# Altium schematic sheet 14-RTL8367.schdoc
size A1
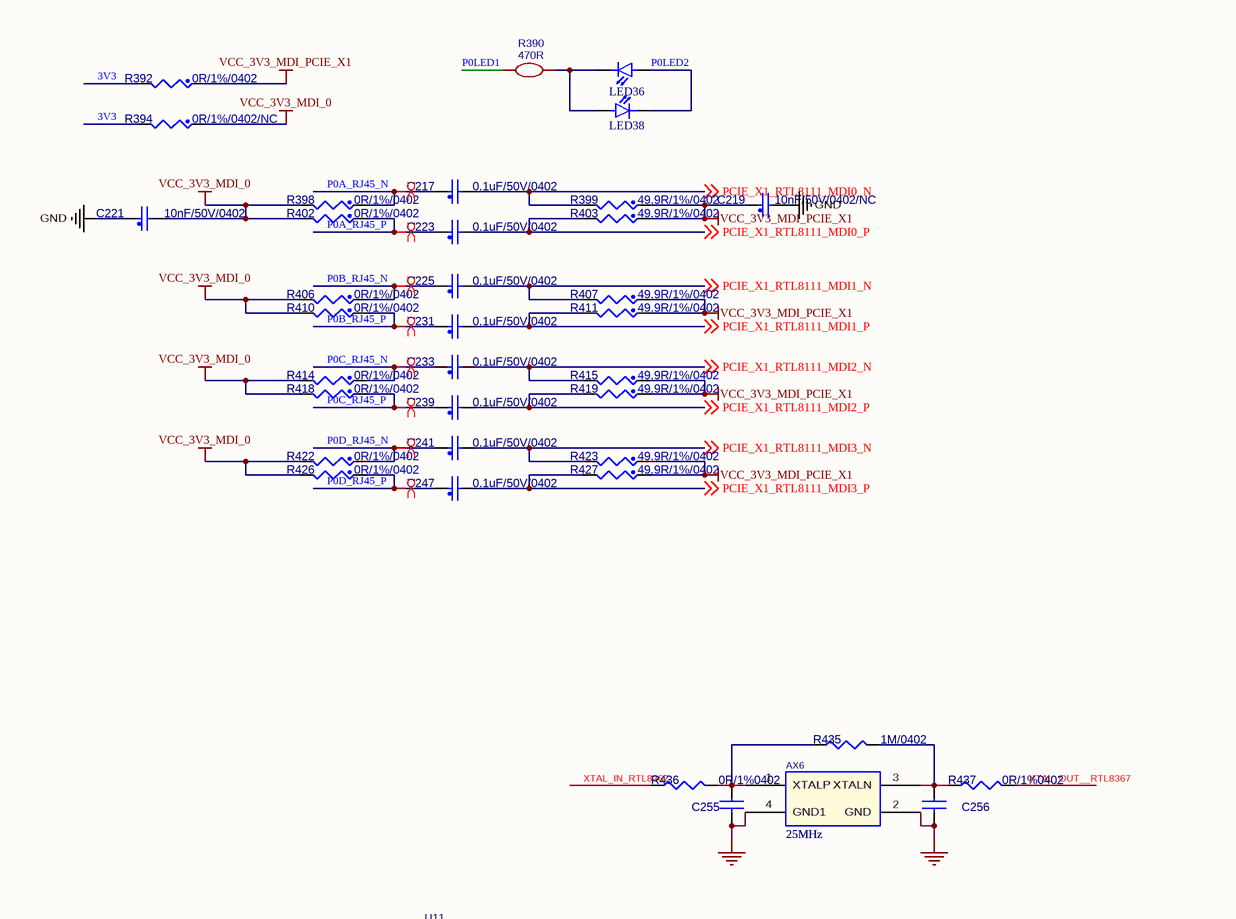
[diagram p0: 14-RTL8367.schdoc, top left]
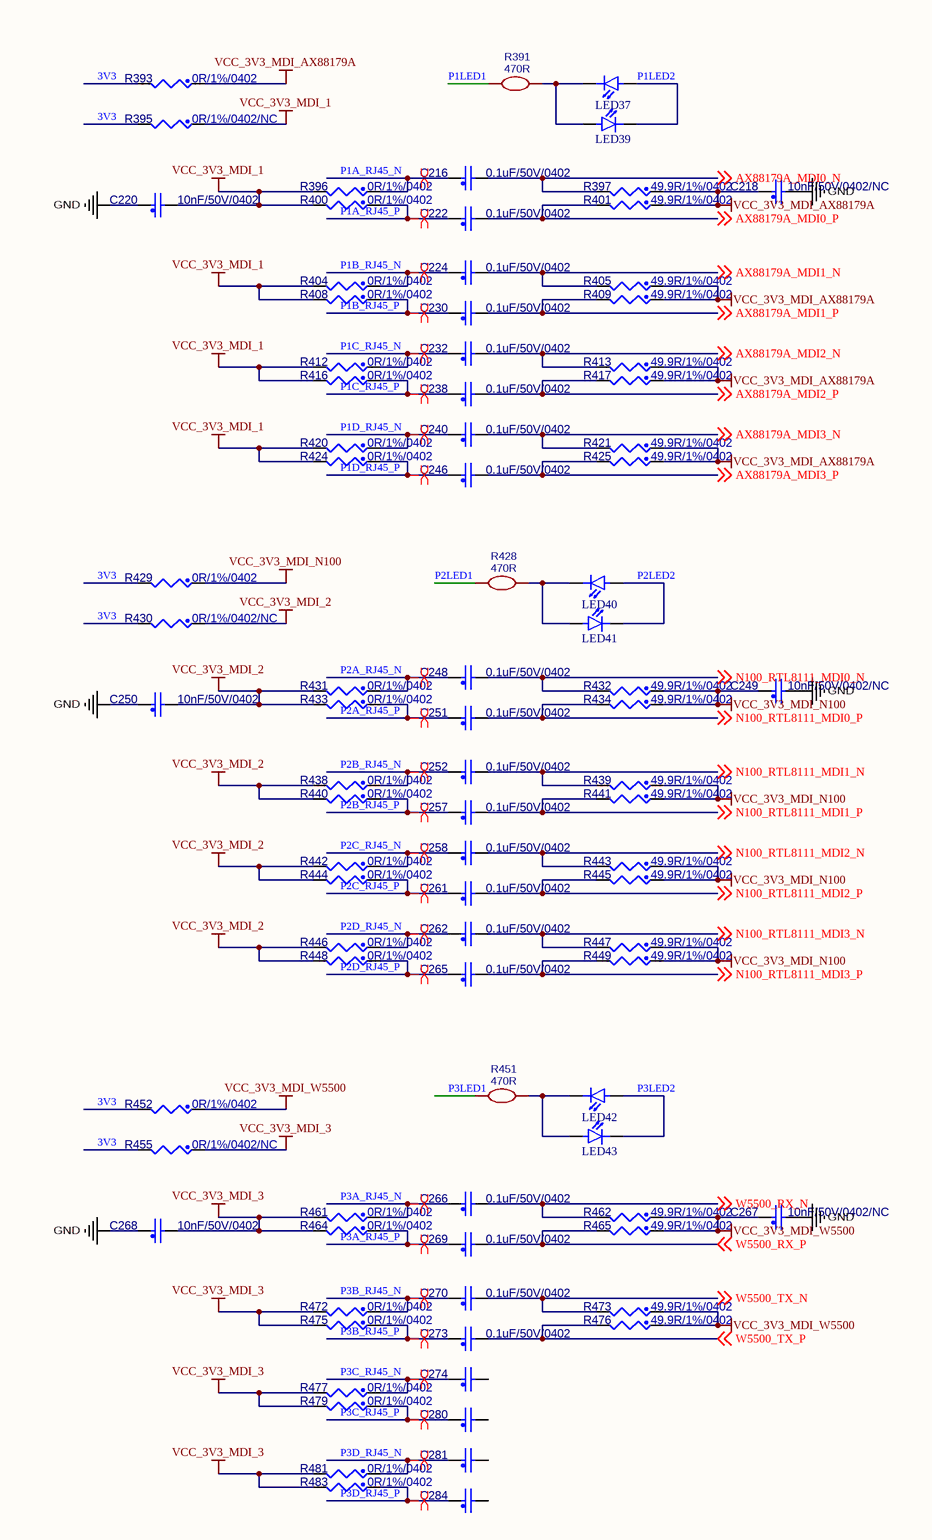
[diagram p1: 14-RTL8367.schdoc, top right]
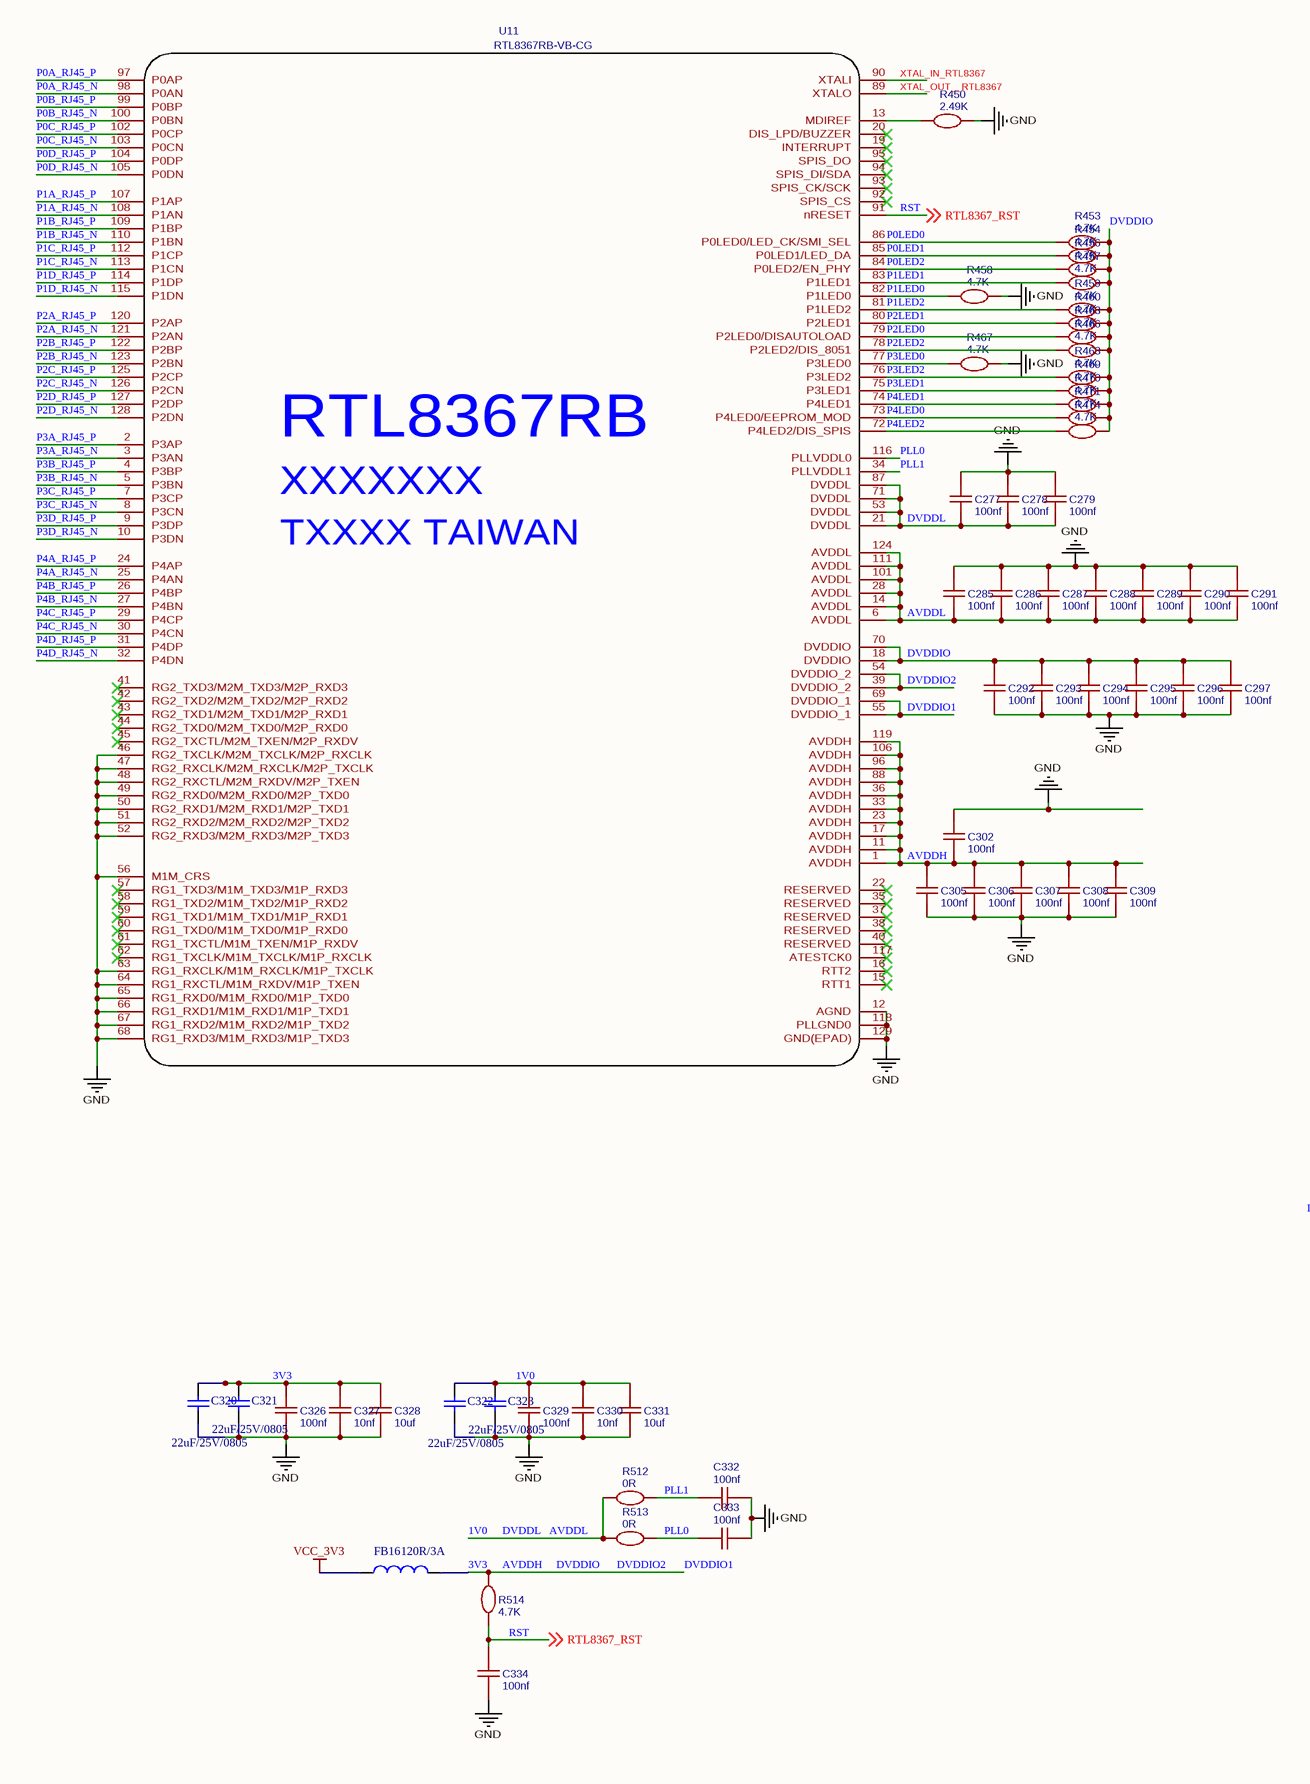
[diagram p2: 14-RTL8367.schdoc, bottom left]
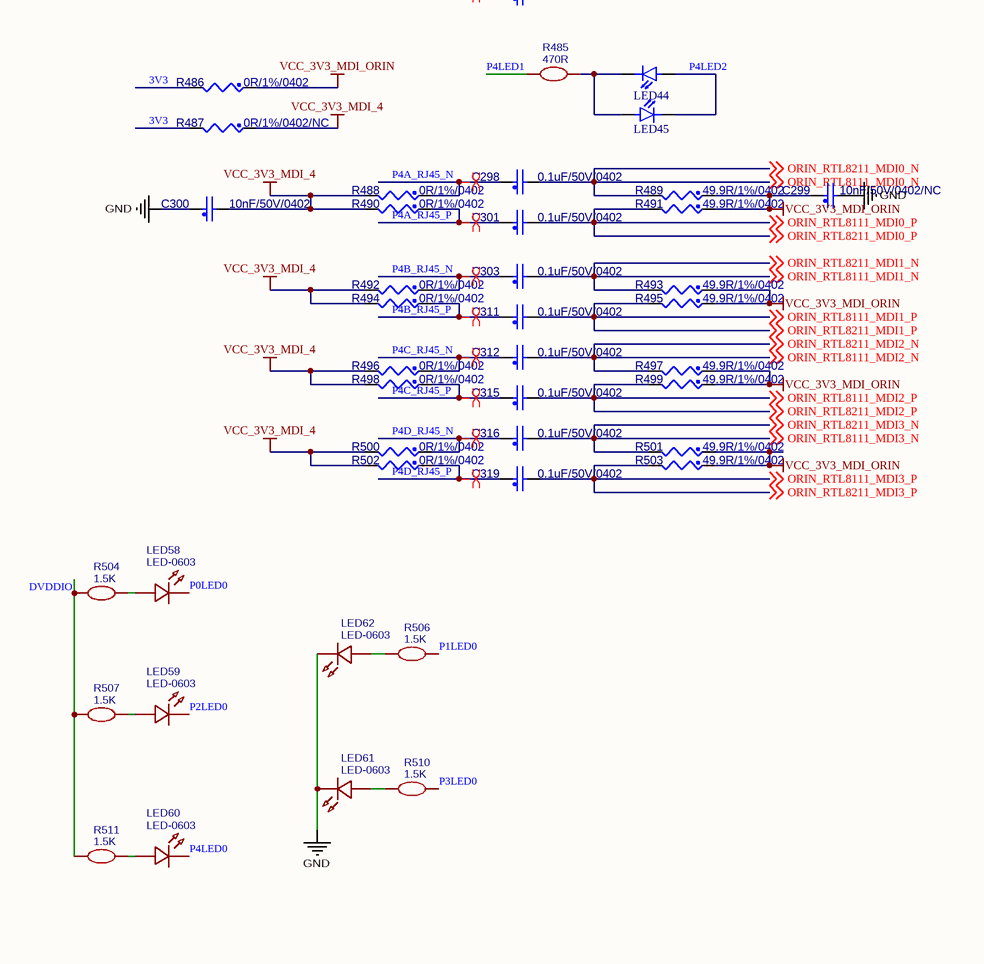
[diagram p3: 14-RTL8367.schdoc, bottom right]

## Parts
AX6  25MHz  [2016]
C216  value 0.1uF/50V/0402  [C0402]  (hidden comment: CAP_NP)
C217  value 0.1uF/50V/0402  [C0402]  (hidden comment: CAP_NP)
C218  value 10nF/50V/0402/NC  [C0402]  (hidden comment: CAP_NP)
C219  value 10nF/50V/0402/NC  [C0402]  (hidden comment: CAP_NP)
C220  value 10nF/50V/0402  [C0402]  (hidden comment: CAP_NP)
C221  value 10nF/50V/0402  [C0402]  (hidden comment: CAP_NP)
C222  value 0.1uF/50V/0402  [C0402]  (hidden comment: CAP_NP)
C223  value 0.1uF/50V/0402  [C0402]  (hidden comment: CAP_NP)
C224  value 0.1uF/50V/0402  [C0402]  (hidden comment: CAP_NP)
C225  value 0.1uF/50V/0402  [C0402]  (hidden comment: CAP_NP)
C230  value 0.1uF/50V/0402  [C0402]  (hidden comment: CAP_NP)
C231  value 0.1uF/50V/0402  [C0402]  (hidden comment: CAP_NP)
C232  value 0.1uF/50V/0402  [C0402]  (hidden comment: CAP_NP)
C233  value 0.1uF/50V/0402  [C0402]  (hidden comment: CAP_NP)
C238  value 0.1uF/50V/0402  [C0402]  (hidden comment: CAP_NP)
C239  value 0.1uF/50V/0402  [C0402]  (hidden comment: CAP_NP)
C240  value 0.1uF/50V/0402  [C0402]  (hidden comment: CAP_NP)
C241  value 0.1uF/50V/0402  [C0402]  (hidden comment: CAP_NP)
C246  value 0.1uF/50V/0402  [C0402]  (hidden comment: CAP_NP)
C247  value 0.1uF/50V/0402  [C0402]  (hidden comment: CAP_NP)
C248  value 0.1uF/50V/0402  [C0402]  (hidden comment: CAP_NP)
C249  value 10nF/50V/0402/NC  [C0402]  (hidden comment: CAP_NP)
C250  value 10nF/50V/0402  [C0402]  (hidden comment: CAP_NP)
C251  value 0.1uF/50V/0402  [C0402]  (hidden comment: CAP_NP)
C252  value 0.1uF/50V/0402  [C0402]  (hidden comment: CAP_NP)
C255  CAP NP_Dup3  [C0402]  (value not drawn)
C256  CAP NP_Dup3  [C0402]  (value not drawn)
C257  value 0.1uF/50V/0402  [C0402]  (hidden comment: CAP_NP)
C258  value 0.1uF/50V/0402  [C0402]  (hidden comment: CAP_NP)
C261  value 0.1uF/50V/0402  [C0402]  (hidden comment: CAP_NP)
C262  value 0.1uF/50V/0402  [C0402]  (hidden comment: CAP_NP)
C265  value 0.1uF/50V/0402  [C0402]  (hidden comment: CAP_NP)
C266  value 0.1uF/50V/0402  [C0402]  (hidden comment: CAP_NP)
C267  value 10nF/50V/0402/NC  [C0402]  (hidden comment: CAP_NP)
C268  value 10nF/50V/0402  [C0402]  (hidden comment: CAP_NP)
C269  value 0.1uF/50V/0402  [C0402]  (hidden comment: CAP_NP)
C270  value 0.1uF/50V/0402  [C0402]  (hidden comment: CAP_NP)
C273  value 0.1uF/50V/0402  [C0402]  (hidden comment: CAP_NP)
C274  CAP_NP  [C0402]  (value not drawn)
C277  100nf  [C0402]
C278  100nf  [C0402]
C279  100nf  [C0402]
C280  CAP_NP  [C0402]  (value not drawn)
C281  CAP_NP  [C0402]  (value not drawn)
C284  CAP_NP  [C0402]  (value not drawn)
C285  100nf  [C0402]
C286  100nf  [C0402]
C287  100nf  [C0402]
C288  100nf  [C0402]
C289  100nf  [C0402]
C290  100nf  [C0402]
C291  100nf  [C0402]
C292  100nf  [C0402]
C293  100nf  [C0402]
C294  100nf  [C0402]
C295  100nf  [C0402]
C296  100nf  [C0402]
C297  100nf  [C0402]
C298  value 0.1uF/50V/0402  [C0402]  (hidden comment: CAP_NP)
C299  value 10nF/50V/0402/NC  [C0402]  (hidden comment: CAP_NP)
C300  value 10nF/50V/0402  [C0402]  (hidden comment: CAP_NP)
C301  value 0.1uF/50V/0402  [C0402]  (hidden comment: CAP_NP)
C302  100nf  [C0402]
C303  value 0.1uF/50V/0402  [C0402]  (hidden comment: CAP_NP)
C305  100nf  [C0402]
C306  100nf  [C0402]
C307  100nf  [C0402]
C308  100nf  [C0402]
C309  100nf  [C0402]
C311  value 0.1uF/50V/0402  [C0402]  (hidden comment: CAP_NP)
C312  value 0.1uF/50V/0402  [C0402]  (hidden comment: CAP_NP)
C315  value 0.1uF/50V/0402  [C0402]  (hidden comment: CAP_NP)
C316  value 0.1uF/50V/0402  [C0402]  (hidden comment: CAP_NP)
C319  value 0.1uF/50V/0402  [C0402]  (hidden comment: CAP_NP)
C320  22uF/25V/0805  [C0805]
C321  22uF/25V/0805  [C0805]
C322  22uF/25V/0805  [C0805]
C323  22uF/25V/0805  [C0805]
C326  100nf  [C0402]
C327  10nf  [C0402]
C328  10uf  [C0805]
C329  100nf  [C0402]
C330  10nf  [C0402]
C331  10uf  [C0805]
C332  100nf  [C0402]
C333  100nf  [C0402]
C334  100nf  [C0402]
FB16  120R/3A  [L0603]
LED36  LED_GREEN  [LED0603]  (value not drawn)
LED37  LED_GREEN  [LED0603]  (value not drawn)
LED38  LED_GREEN  [LED0603]  (value not drawn)
LED39  LED_GREEN  [LED0603]  (value not drawn)
LED40  LED_GREEN  [LED0603]  (value not drawn)
LED41  LED_GREEN  [LED0603]  (value not drawn)
LED42  LED_GREEN  [LED0603]  (value not drawn)
LED43  LED_GREEN  [LED0603]  (value not drawn)
LED44  LED_GREEN  [LED0603]  (value not drawn)
LED45  LED_GREEN  [LED0603]  (value not drawn)
LED58  LED-0603  [LED0603]
LED59  LED-0603  [LED0603]
LED60  LED-0603  [LED0603]
LED61  LED-0603  [LED0603]
LED62  LED-0603  [LED0603]
R390  470R  [R0402]
R391  470R  [R0402]
R392  value 0R/1%/0402  [R0402]  (hidden comment: RES_Dup2)
R393  value 0R/1%/0402  [R0402]  (hidden comment: RES_Dup2)
R394  value 0R/1%/0402/NC  [R0402]  (hidden comment: RES_Dup2)
R395  value 0R/1%/0402/NC  [R0402]  (hidden comment: RES_Dup2)
R396  value 0R/1%/0402  [R0402]  (hidden comment: RES_Dup2)
R397  value 49.9R/1%/0402  [R0402]  (hidden comment: RES_Dup2)
R398  value 0R/1%/0402  [R0402]  (hidden comment: RES_Dup2)
R399  value 49.9R/1%/0402  [R0402]  (hidden comment: RES_Dup2)
R400  value 0R/1%/0402  [R0402]  (hidden comment: RES_Dup2)
R401  value 49.9R/1%/0402  [R0402]  (hidden comment: RES_Dup2)
R402  value 0R/1%/0402  [R0402]  (hidden comment: RES_Dup2)
R403  value 49.9R/1%/0402  [R0402]  (hidden comment: RES_Dup2)
R404  value 0R/1%/0402  [R0402]  (hidden comment: RES_Dup2)
R405  value 49.9R/1%/0402  [R0402]  (hidden comment: RES_Dup2)
R406  value 0R/1%/0402  [R0402]  (hidden comment: RES_Dup2)
R407  value 49.9R/1%/0402  [R0402]  (hidden comment: RES_Dup2)
R408  value 0R/1%/0402  [R0402]  (hidden comment: RES_Dup2)
R409  value 49.9R/1%/0402  [R0402]  (hidden comment: RES_Dup2)
R410  value 0R/1%/0402  [R0402]  (hidden comment: RES_Dup2)
R411  value 49.9R/1%/0402  [R0402]  (hidden comment: RES_Dup2)
R412  value 0R/1%/0402  [R0402]  (hidden comment: RES_Dup2)
R413  value 49.9R/1%/0402  [R0402]  (hidden comment: RES_Dup2)
R414  value 0R/1%/0402  [R0402]  (hidden comment: RES_Dup2)
R415  value 49.9R/1%/0402  [R0402]  (hidden comment: RES_Dup2)
R416  value 0R/1%/0402  [R0402]  (hidden comment: RES_Dup2)
R417  value 49.9R/1%/0402  [R0402]  (hidden comment: RES_Dup2)
R418  value 0R/1%/0402  [R0402]  (hidden comment: RES_Dup2)
R419  value 49.9R/1%/0402  [R0402]  (hidden comment: RES_Dup2)
R420  value 0R/1%/0402  [R0402]  (hidden comment: RES_Dup2)
R421  value 49.9R/1%/0402  [R0402]  (hidden comment: RES_Dup2)
R422  value 0R/1%/0402  [R0402]  (hidden comment: RES_Dup2)
R423  value 49.9R/1%/0402  [R0402]  (hidden comment: RES_Dup2)
R424  value 0R/1%/0402  [R0402]  (hidden comment: RES_Dup2)
R425  value 49.9R/1%/0402  [R0402]  (hidden comment: RES_Dup2)
R426  value 0R/1%/0402  [R0402]  (hidden comment: RES_Dup2)
R427  value 49.9R/1%/0402  [R0402]  (hidden comment: RES_Dup2)
R428  470R  [R0402]
R429  value 0R/1%/0402  [R0402]  (hidden comment: RES_Dup2)
R430  value 0R/1%/0402/NC  [R0402]  (hidden comment: RES_Dup2)
R431  value 0R/1%/0402  [R0402]  (hidden comment: RES_Dup2)
R432  value 49.9R/1%/0402  [R0402]  (hidden comment: RES_Dup2)
R433  value 0R/1%/0402  [R0402]  (hidden comment: RES_Dup2)
R434  value 49.9R/1%/0402  [R0402]  (hidden comment: RES_Dup2)
R435  value 1M/0402  [R0402]  (hidden comment: R_Dup3)
R436  value 0R/1%0402  [R0402]  (hidden comment: R_Dup3)
R437  value 0R/1%0402  [R0402]  (hidden comment: R_Dup3)
R438  value 0R/1%/0402  [R0402]  (hidden comment: RES_Dup2)
R439  value 49.9R/1%/0402  [R0402]  (hidden comment: RES_Dup2)
R440  value 0R/1%/0402  [R0402]  (hidden comment: RES_Dup2)
R441  value 49.9R/1%/0402  [R0402]  (hidden comment: RES_Dup2)
R442  value 0R/1%/0402  [R0402]  (hidden comment: RES_Dup2)
R443  value 49.9R/1%/0402  [R0402]  (hidden comment: RES_Dup2)
R444  value 0R/1%/0402  [R0402]  (hidden comment: RES_Dup2)
R445  value 49.9R/1%/0402  [R0402]  (hidden comment: RES_Dup2)
R446  value 0R/1%/0402  [R0402]  (hidden comment: RES_Dup2)
R447  value 49.9R/1%/0402  [R0402]  (hidden comment: RES_Dup2)
R448  value 0R/1%/0402  [R0402]  (hidden comment: RES_Dup2)
R449  value 49.9R/1%/0402  [R0402]  (hidden comment: RES_Dup2)
R450  2.49K  [R0402]
R451  470R  [R0402]
R452  value 0R/1%/0402  [R0402]  (hidden comment: RES_Dup2)
R453  4.7K  [R0402]
R454  4.7K  [R0402]
R455  value 0R/1%/0402/NC  [R0402]  (hidden comment: RES_Dup2)
R456  4.7K  [R0402]
R457  4.7K  [R0402]
R458  4.7K  [R0402]
R459  4.7K  [R0402]
R460  4.7K  [R0402]
R461  value 0R/1%/0402  [R0402]  (hidden comment: RES_Dup2)
R462  value 49.9R/1%/0402  [R0402]  (hidden comment: RES_Dup2)
R463  4.7K  [R0402]
R464  value 0R/1%/0402  [R0402]  (hidden comment: RES_Dup2)
R465  value 49.9R/1%/0402  [R0402]  (hidden comment: RES_Dup2)
R466  4.7K  [R0402]
R467  4.7K  [R0402]
R468  4.7K  [R0402]
R469  4.7K  [R0402]
R470  4.7K  [R0402]
R471  4.7K  [R0402]
R472  value 0R/1%/0402  [R0402]  (hidden comment: RES_Dup2)
R473  value 49.9R/1%/0402  [R0402]  (hidden comment: RES_Dup2)
R474  4.7K  [R0402]
R475  value 0R/1%/0402  [R0402]  (hidden comment: RES_Dup2)
R476  value 49.9R/1%/0402  [R0402]  (hidden comment: RES_Dup2)
R477  value 0R/1%/0402  [R0402]  (hidden comment: RES_Dup2)
R479  value 0R/1%/0402  [R0402]  (hidden comment: RES_Dup2)
R481  value 0R/1%/0402  [R0402]  (hidden comment: RES_Dup2)
R483  value 0R/1%/0402  [R0402]  (hidden comment: RES_Dup2)
R485  470R  [R0402]
R486  value 0R/1%/0402  [R0402]  (hidden comment: RES_Dup2)
R487  value 0R/1%/0402/NC  [R0402]  (hidden comment: RES_Dup2)
R488  value 0R/1%/0402  [R0402]  (hidden comment: RES_Dup2)
R489  value 49.9R/1%/0402  [R0402]  (hidden comment: RES_Dup2)
R490  value 0R/1%/0402  [R0402]  (hidden comment: RES_Dup2)
R491  value 49.9R/1%/0402  [R0402]  (hidden comment: RES_Dup2)
R492  value 0R/1%/0402  [R0402]  (hidden comment: RES_Dup2)
R493  value 49.9R/1%/0402  [R0402]  (hidden comment: RES_Dup2)
R494  value 0R/1%/0402  [R0402]  (hidden comment: RES_Dup2)
R495  value 49.9R/1%/0402  [R0402]  (hidden comment: RES_Dup2)
R496  value 0R/1%/0402  [R0402]  (hidden comment: RES_Dup2)
R497  value 49.9R/1%/0402  [R0402]  (hidden comment: RES_Dup2)
R498  value 0R/1%/0402  [R0402]  (hidden comment: RES_Dup2)
R499  value 49.9R/1%/0402  [R0402]  (hidden comment: RES_Dup2)
R500  value 0R/1%/0402  [R0402]  (hidden comment: RES_Dup2)
R501  value 49.9R/1%/0402  [R0402]  (hidden comment: RES_Dup2)
R502  value 0R/1%/0402  [R0402]  (hidden comment: RES_Dup2)
R503  value 49.9R/1%/0402  [R0402]  (hidden comment: RES_Dup2)
R504  1.5K  [R0402]
R506  1.5K  [R0402]
R507  1.5K  [R0402]
R510  1.5K  [R0402]
R511  1.5K  [R0402]
R512  0R  [R0402]
R513  0R  [R0402]
R514  4.7K  [R0402]
U11  RTL8367RB-VB-CG  [RTL8367RB_LQFP128]

## Nets
GND: AX6.2(GND) AX6.4(GND1) C218.2 C219.2 C220.1 C221.1 C249.2 C250.1 C255.2 C256.2 C267.2 C268.1 C277.1 C278.1 C279.1 C285.1 C286.1 C287.1 C288.1 C289.1 C290.1 C291.1 C292.2 C293.2 C294.2 C295.2 C296.2 C297.2 C299.2 C300.1 C302.1 C305.2 C306.2 C307.2 C308.2 C309.2 C320.1 C321.1 C322.1 C323.1 C326.2 C327.2 C328.2 C329.2 C330.2 C331.2 C332.2 C333.2 C334.2 LED61.2 LED62.2 R450.2 R458.2 R467.2 U11.12(AGND) U11.46(RG2_TXCLK/M2M_TXCLK/M2P_RXCLK) U11.47(RG2_RXCLK/M2M_RXCLK/M2P_TXCLK) U11.48(RG2_RXCTL/M2M_RXDV/M2P_TXEN) U11.49(RG2_RXD0/M2M_RXD0/M2P_TXD0) U11.50(RG2_RXD1/M2M_RXD1/M2P_TXD1) U11.51(RG2_RXD2/M2M_RXD2/M2P_TXD2) U11.52(RG2_RXD3/M2M_RXD3/M2P_TXD3) U11.56(M1M_CRS) U11.63(RG1_RXCLK/M1M_RXCLK/M1P_TXCLK) U11.64(RG1_RXCTL/M1M_RXDV/M1P_TXEN) U11.65(RG1_RXD0/M1M_RXD0/M1P_TXD0) U11.66(RG1_RXD1/M1M_RXD1/M1P_TXD1) U11.67(RG1_RXD2/M1M_RXD2/M1P_TXD2) U11.68(RG1_RXD3/M1M_RXD3/M1P_TXD3) U11.118(PLLGND0) U11.129(GND(EPAD))
VCC_3V3: FB16.1
VCC_3V3_MDI_0: C221.2 R394.1 R398.2 R402.2 R406.2 R410.2 R414.2 R418.2 R422.2 R426.2
VCC_3V3_MDI_1: C220.2 R395.1 R396.2 R400.2 R404.2 R408.2 R412.2 R416.2 R420.2 R424.2
VCC_3V3_MDI_2: C250.2 R430.1 R431.2 R433.2 R438.2 R440.2 R442.2 R444.2 R446.2 R448.2
VCC_3V3_MDI_3: C268.2 R455.1 R461.2 R464.2 R472.2 R475.2 R477.2 R479.2 R481.2 R483.2
VCC_3V3_MDI_4: C300.2 R487.1 R488.2 R490.2 R492.2 R494.2 R496.2 R498.2 R500.2 R502.2
VCC_3V3_MDI_AX88179A: C218.1 R393.1 R397.1 R401.1 R405.1 R409.1 R413.1 R417.1 R421.1 R425.1
VCC_3V3_MDI_N100: C249.1 R429.1 R432.1 R434.1 R439.1 R441.1 R443.1 R445.1 R447.1 R449.1
VCC_3V3_MDI_ORIN: C299.1 R486.1 R489.1 R491.1 R493.1 R495.1 R497.1 R499.1 R501.1 R503.1
VCC_3V3_MDI_PCIE_X1: C219.1 R392.1 R399.1 R403.1 R407.1 R411.1 R415.1 R419.1 R423.1 R427.1
VCC_3V3_MDI_W5500: C267.1 R452.1 R462.1 R465.1 R473.1 R476.1
1V0: C277.2 C278.2 C279.2 C285.2 C286.2 C287.2 C288.2 C289.2 C290.2 C291.2 C322.2 C323.2 C329.1 C330.1 C331.1 R512.1 R513.1 U11.6(AVDDL) U11.14(AVDDL) U11.21(DVDDL) U11.28(AVDDL) U11.53(DVDDL) U11.71(DVDDL) U11.87(DVDDL) U11.101(AVDDL) U11.111(AVDDL) U11.124(AVDDL)  [also labelled AVDDL, DVDDL]
3V3: C292.1 C293.1 C294.1 C295.1 C296.1 C297.1 C302.2 C305.1 C306.1 C307.1 C308.1 C309.1 C320.2 C321.2 C326.1 C327.1 C328.1 FB16.2 R392.2 R393.2 R394.2 R395.2 R429.2 R430.2 R452.2 R453.2 R454.2 R455.2 R456.2 R457.2 R459.2 R460.2 R463.2 R466.2 R468.2 R469.2 R470.2 R471.2 R474.2 R486.2 R487.2 R504.1 R507.1 R511.1 R514.2 U11.1(AVDDH) U11.11(AVDDH) U11.17(AVDDH) U11.18(DVDDIO) U11.23(AVDDH) U11.33(AVDDH) U11.36(AVDDH) U11.39(DVDDIO_2) U11.54(DVDDIO_2) U11.55(DVDDIO_1) U11.69(DVDDIO_1) U11.70(DVDDIO) U11.88(AVDDH) U11.96(AVDDH) U11.106(AVDDH) U11.119(AVDDH)  [also labelled AVDDH, DVDDIO, DVDDIO1, DVDDIO2]
AX88179A_MDI0_N: C216.2 R397.2 ; off-sheet AX88179A_MDI0_N
AX88179A_MDI0_P: C222.2 R401.2 ; off-sheet AX88179A_MDI0_P
AX88179A_MDI1_N: C224.2 R405.2 ; off-sheet AX88179A_MDI1_N
AX88179A_MDI1_P: C230.2 R409.2 ; off-sheet AX88179A_MDI1_P
AX88179A_MDI2_N: C232.2 R413.2 ; off-sheet AX88179A_MDI2_N
AX88179A_MDI2_P: C238.2 R417.2 ; off-sheet AX88179A_MDI2_P
AX88179A_MDI3_N: C240.2 R421.2 ; off-sheet AX88179A_MDI3_N
AX88179A_MDI3_P: C246.2 R425.2 ; off-sheet AX88179A_MDI3_P
N100_RTL8111_MDI0_N: C248.2 R432.2 ; off-sheet N100_RTL8111_MDI0_N
N100_RTL8111_MDI0_P: C251.2 R434.2 ; off-sheet N100_RTL8111_MDI0_P
N100_RTL8111_MDI1_N: C252.2 R439.2 ; off-sheet N100_RTL8111_MDI1_N
N100_RTL8111_MDI1_P: C257.2 R441.2 ; off-sheet N100_RTL8111_MDI1_P
N100_RTL8111_MDI2_N: C258.2 R443.2 ; off-sheet N100_RTL8111_MDI2_N
N100_RTL8111_MDI2_P: C261.2 R445.2 ; off-sheet N100_RTL8111_MDI2_P
N100_RTL8111_MDI3_N: C262.2 R447.2 ; off-sheet N100_RTL8111_MDI3_N
N100_RTL8111_MDI3_P: C265.2 R449.2 ; off-sheet N100_RTL8111_MDI3_P
ORIN_RTL8111_MDI0_N: C298.2 R489.2 ; off-sheet ORIN_RTL8211_MDI0_N, off-sheet ORIN_RTL8111_MDI0_N  [also labelled ORIN_RTL8211_MDI0_N]
ORIN_RTL8111_MDI0_P: C301.2 R491.2 ; off-sheet ORIN_RTL8211_MDI0_P, off-sheet ORIN_RTL8111_MDI0_P  [also labelled ORIN_RTL8211_MDI0_P]
ORIN_RTL8111_MDI1_N: C303.2 R493.2 ; off-sheet ORIN_RTL8211_MDI1_N, off-sheet ORIN_RTL8111_MDI1_N  [also labelled ORIN_RTL8211_MDI1_N]
ORIN_RTL8111_MDI1_P: C311.2 R495.2 ; off-sheet ORIN_RTL8211_MDI1_P, off-sheet ORIN_RTL8111_MDI1_P  [also labelled ORIN_RTL8211_MDI1_P]
ORIN_RTL8111_MDI2_N: C312.2 R497.2 ; off-sheet ORIN_RTL8211_MDI2_N, off-sheet ORIN_RTL8111_MDI2_N  [also labelled ORIN_RTL8211_MDI2_N]
ORIN_RTL8111_MDI2_P: C315.2 R499.2 ; off-sheet ORIN_RTL8211_MDI2_P, off-sheet ORIN_RTL8111_MDI2_P  [also labelled ORIN_RTL8211_MDI2_P]
ORIN_RTL8111_MDI3_N: C316.2 R501.2 ; off-sheet ORIN_RTL8211_MDI3_N, off-sheet ORIN_RTL8111_MDI3_N  [also labelled ORIN_RTL8211_MDI3_N]
ORIN_RTL8111_MDI3_P: C319.2 R503.2 ; off-sheet ORIN_RTL8211_MDI3_P, off-sheet ORIN_RTL8111_MDI3_P  [also labelled ORIN_RTL8211_MDI3_P]
P0A_RJ45_N: C217.1 R398.1 U11.98(P0AN)
P0A_RJ45_P: C223.1 R402.1 U11.97(P0AP)
P0B_RJ45_N: C225.1 R406.1 U11.100(P0BN)
P0B_RJ45_P: C231.1 R410.1 U11.99(P0BP)
P0C_RJ45_N: C233.1 R414.1 U11.103(P0CN)
P0C_RJ45_P: C239.1 R418.1 U11.102(P0CP)
P0D_RJ45_N: C241.1 R422.1 U11.105(P0DN)
P0D_RJ45_P: C247.1 R426.1 U11.104(P0DP)
P0LED0: LED58.2 R453.1 U11.86(P0LED0/LED_CK/SMI_SEL)
P0LED1: R390.1 R454.1 U11.85(P0LED1/LED_DA)
P0LED2: LED36.1 LED38.2 R456.1 U11.84(P0LED2/EN_PHY)
P1A_RJ45_N: C216.1 R396.1 U11.108(P1AN)
P1A_RJ45_P: C222.1 R400.1 U11.107(P1AP)
P1B_RJ45_N: C224.1 R404.1 U11.110(P1BN)
P1B_RJ45_P: C230.1 R408.1 U11.109(P1BP)
P1C_RJ45_N: C232.1 R412.1 U11.113(P1CN)
P1C_RJ45_P: C238.1 R416.1 U11.112(P1CP)
P1D_RJ45_N: C240.1 R420.1 U11.115(P1DN)
P1D_RJ45_P: C246.1 R424.1 U11.114(P1DP)
P1LED0: R458.1 R506.2 U11.82(P1LED0)
P1LED1: R391.1 R457.1 U11.83(P1LED1)
P1LED2: LED37.1 LED39.2 R459.1 U11.81(P1LED2)
P2A_RJ45_N: C248.1 R431.1 U11.121(P2AN)
P2A_RJ45_P: C251.1 R433.1 U11.120(P2AP)
P2B_RJ45_N: C252.1 R438.1 U11.123(P2BN)
P2B_RJ45_P: C257.1 R440.1 U11.122(P2BP)
P2C_RJ45_N: C258.1 R442.1 U11.126(P2CN)
P2C_RJ45_P: C261.1 R444.1 U11.125(P2CP)
P2D_RJ45_N: C262.1 R446.1 U11.128(P2DN)
P2D_RJ45_P: C265.1 R448.1 U11.127(P2DP)
P2LED0: LED59.2 R463.1 U11.79(P2LED0/DISAUTOLOAD)
P2LED1: R428.1 R460.1 U11.80(P2LED1)
P2LED2: LED40.1 LED41.2 R466.1 U11.78(P2LED2/DIS_8051)
P3A_RJ45_N: C266.1 R461.1 U11.3(P3AN)
P3A_RJ45_P: C269.1 R464.1 U11.2(P3AP)
P3B_RJ45_N: C270.1 R472.1 U11.5(P3BN)
P3B_RJ45_P: C273.1 R475.1 U11.4(P3BP)
P3C_RJ45_N: C274.1 R477.1 U11.8(P3CN)
P3C_RJ45_P: C280.1 R479.1 U11.7(P3CP)
P3D_RJ45_N: C281.1 R481.1 U11.10(P3DN)
P3D_RJ45_P: C284.1 R483.1 U11.9(P3DP)
P3LED0: R467.1 R510.2 U11.77(P3LED0)
P3LED1: R451.1 R469.1 U11.75(P3LED1)
P3LED2: LED42.1 LED43.2 R468.1 U11.76(P3LED2)
P4A_RJ45_N: C298.1 R488.1 U11.25(P4AN)
P4A_RJ45_P: C301.1 R490.1 U11.24(P4AP)
P4B_RJ45_N: C303.1 R492.1 U11.27(P4BN)
P4B_RJ45_P: C311.1 R494.1 U11.26(P4BP)
P4C_RJ45_N: C312.1 R496.1 U11.30(P4CN)
P4C_RJ45_P: C315.1 R498.1 U11.29(P4CP)
P4D_RJ45_N: C316.1 R500.1 U11.32(P4DN)
P4D_RJ45_P: C319.1 R502.1 U11.31(P4DP)
P4LED0: LED60.2 R471.1 U11.73(P4LED0/EEPROM_MOD)
P4LED1: R470.1 R485.1 U11.74(P4LED1)
P4LED2: LED44.1 LED45.2 R474.1 U11.72(P4LED2/DIS_SPIS)
PCIE_X1_RTL8111_MDI0_N: C217.2 R399.2 ; off-sheet PCIE_X1_RTL8111_MDI0_N
PCIE_X1_RTL8111_MDI0_P: C223.2 R403.2 ; off-sheet PCIE_X1_RTL8111_MDI0_P
PCIE_X1_RTL8111_MDI1_N: C225.2 R407.2 ; off-sheet PCIE_X1_RTL8111_MDI1_N
PCIE_X1_RTL8111_MDI1_P: C231.2 R411.2 ; off-sheet PCIE_X1_RTL8111_MDI1_P
PCIE_X1_RTL8111_MDI2_N: C233.2 R415.2 ; off-sheet PCIE_X1_RTL8111_MDI2_N
PCIE_X1_RTL8111_MDI2_P: C239.2 R419.2 ; off-sheet PCIE_X1_RTL8111_MDI2_P
PCIE_X1_RTL8111_MDI3_N: C241.2 R423.2 ; off-sheet PCIE_X1_RTL8111_MDI3_N
PCIE_X1_RTL8111_MDI3_P: C247.2 R427.2 ; off-sheet PCIE_X1_RTL8111_MDI3_P
PLL0: C333.1 R513.2 U11.116(PLLVDDL0)
PLL1: C332.1 R512.2 U11.34(PLLVDDL1)
RST: C334.1 R514.1 U11.91(nRESET) ; off-sheet RTL8367_RST  [also labelled RTL8367_RST]
W5500_RX_N: C266.2 R462.2 ; off-sheet W5500_RX_N
W5500_RX_P: C269.2 R465.2 ; off-sheet W5500_RX_P
W5500_TX_N: C270.2 R473.2 ; off-sheet W5500_TX_N
W5500_TX_P: C273.2 R476.2 ; off-sheet W5500_TX_P
XTAL_IN_RTL8367: R436.1 U11.90(XTALI)
XTAL_OUT__RTL8367: R437.2 U11.89(XTALO)
NetAX6_1: AX6.1(XTALP) C255.1 R435.1 R436.2
NetAX6_3: AX6.3(XTALN) C256.1 R435.2 R437.1
NetLED36_2: LED36.2 LED38.1 R390.2
NetLED37_2: LED37.2 LED39.1 R391.2
NetLED40_2: LED40.2 LED41.1 R428.2
NetLED42_2: LED42.2 LED43.1 R451.2
NetLED44_2: LED44.2 LED45.1 R485.2
NetLED58_1: LED58.1 R504.2
NetLED59_1: LED59.1 R507.2
NetLED60_1: LED60.1 R511.2
NetLED61_1: LED61.1 R510.1
NetLED62_1: LED62.1 R506.1
NetR450_1: R450.1 U11.13(MDIREF)

Not connected (* = marked no-connect by the designer): C274 2; C280 2; C281 2; C284 2; U11 15(RTT1)* 16(RTT2)* 19(INTERRUPT)* 20(DIS_LPD/BUZZER)* 22(RESERVED)* 35(RESERVED)* 37(RESERVED)* 38(RESERVED)* 40(RESERVED)* 41(RG2_TXD3/M2M_TXD3/M2P_RXD3)* 42(RG2_TXD2/M2M_TXD2/M2P_RXD2)* 43(RG2_TXD1/M2M_TXD1/M2P_RXD1)* 44(RG2_TXD0/M2M_TXD0/M2P_RXD0)* 45(RG2_TXCTL/M2M_TXEN/M2P_RXDV)* 57(RG1_TXD3/M1M_TXD3/M1P_RXD3)* 58(RG1_TXD2/M1M_TXD2/M1P_RXD2)* 59(RG1_TXD1/M1M_TXD1/M1P_RXD1)* 60(RG1_TXD0/M1M_TXD0/M1P_RXD0)* 61(RG1_TXCTL/M1M_TXEN/M1P_RXDV)* 62(RG1_TXCLK/M1M_TXCLK/M1P_RXCLK)* 92(SPIS_CS)* 93(SPIS_CK/SCK)* 94(SPIS_DI/SDA)* 95(SPIS_DO)* 117(ATESTCK0)*

## Layout directives
differential pair: P0A_RJ45_N, P0A_RJ45_P, P0B_RJ45_N, P0B_RJ45_P, P0C_RJ45_N, P0C_RJ45_P, P0D_RJ45_N, P0D_RJ45_P, P1A_RJ45_N, P1A_RJ45_P, P1B_RJ45_N, P1B_RJ45_P, P1C_RJ45_N, P1C_RJ45_P, P1D_RJ45_N, P1D_RJ45_P, P2A_RJ45_N, P2A_RJ45_P, P2B_RJ45_N, P2B_RJ45_P, P2C_RJ45_N, P2C_RJ45_P, P2D_RJ45_N, P2D_RJ45_P, P3A_RJ45_N, P3A_RJ45_P, P3B_RJ45_N, P3B_RJ45_P, P3C_RJ45_N, P3C_RJ45_P, P3D_RJ45_N, P3D_RJ45_P, P4A_RJ45_N, P4A_RJ45_P, P4B_RJ45_N, P4B_RJ45_P, P4C_RJ45_N, P4C_RJ45_P, P4D_RJ45_N, P4D_RJ45_P

## Notes on the sheet
- (in symbol RTL8367RB-VB-CG) RTL8367RB; XXXXXXX; TXXXX TAIWAN

## Library data of the parts
AX6 = XTAL_0: Part Reference: AX3; PCB Footprint: CRY5032; Value: 25MHz
C216-C225 C230-C233 C238-C241 C246-C252 C257 C258 C261 C262 C265-C270 C273 C274 C280 C281 C284 C298-C301 C303 C311 C312 C315 C316 C319 = CAP_NP: GCM155R71H104KE02/MURATA; Part Reference: C15; CLASS: DISCRETE; FPLIST: CC0402_25,CC0402_HD,CC0402_CC; CAD_APPROVED: Yes; MFG_PN01: 0402YC104KAT2A; MFG_NAME01: AVX; Tolerance: 10%; AGILE_PN: 150-75182; VOLTAGE: 16V; HEIGHT: 0.635MM; ROHS: Yes; TOL: 10%; PCB Footprint: C0402
C255 = CAP NP_Dup3: Part Reference: C71; Value: 20pF/50V X7R; PCB Footprint: C0402
C256 = CAP NP_Dup3: Part Reference: C72; Value: 20pF/50V X7R; PCB Footprint: C0402
C277-C279 C285-C297 C302 C305-C309 C326 C329 C332-C334 = 100nf: nameAlias: Value(F); Contributor: LCEDA_Lib; spicePre: C; spiceSymbolName: C_0201_US
C320-C323 = CAP: Capacitor; Value: 100pF; Published: 8-Jun-2000; Revision: July-2002: Re-released for DXP Platform.; Publisher: Altium Limited
C327 C330 = 10nf: nameAlias: Value(F); Contributor: LCEDA_Lib; spicePre: C; spiceSymbolName: C_0201_US
C328 C331 = 10uf: nameAlias: Value(F); Contributor: LCEDA_Lib; spicePre: C; spiceSymbolName: C_0201_US
FB16 = Inductor: BLM18KG121TN1D; Code_IEC: 1005; Value: 10mH; Published: 8-Jun-2000; LatestRevisionDate: 29-May-2009; LatestRevisionNote: IPC-7351 Footprint Added.; PackageReference: 0402-A; Publisher: Altium Limited; PackageDescription: Chip Inductor; Code_JEITA: 0402
LED36-LED45 = LED
LED58-LED62 = LED-0603: Manufacturer: EVERLIGHT(台湾亿光); Manufacturer Part: 19-217/R6C-AL1M2VY/3T; Contributor: LCEDA_01; Supplier Part: C72044; Supplier: LCSC; spicePre: L; spiceSymbolName: LED-0603_R
R390 R391 R428 R451 R485 = 470R: nameAlias: Value(Ω); Contributor: LCEDA_Lib; spicePre: R; spiceSymbolName: R_0603_EU
R392-R427 R429-R434 R438-R449 R452 R455 R461 R462 R464 R465 R472 R473 R475-R477 R479 R481 R483 R486-R503 = RES_Dup2: AC0402FR-070RL/YAGEO; Part Reference: R97; CLASS: DISCRETE; SIGNAL_MODEL: DEFAULT_RESISTOR_33.000000OHM_2_1; FPLIST: RC0603_OV; CAD_APPROVED: Yes; MFG_PN01: CR-02FL6---33R; MFG_NAME01: YAGEO; Tolerance: 1%; AGILE_PN: 470-75790; TOL: 5%; ROHS: Yes; HEIGHT: 0.4MM; PCB Footprint: R0402
R435 R436 = R_Dup3: Part Reference: R130; PCB Footprint: R0402
R437 = R_Dup3: Part Reference: R131; PCB Footprint: R0402
R450 = 2.49K: nameAlias: Value(Ω); Contributor: LCEDA_Lib; spicePre: R; spiceSymbolName: R_0603_EU
R453 R454 R456-R460 R463 R466-R471 R474 R514 = 4.7K: nameAlias: Value(Ω); Contributor: LCEDA_Lib; spicePre: R; spiceSymbolName: R_0603_EU
R504 R506 R507 R510 R511 = 1.5K: nameAlias: Value(Ω); Contributor: LCEDA_Lib; spicePre: R; spiceSymbolName: R_0603_EU
R512 R513 = 0R: nameAlias: Value(Ω); Contributor: LCEDA_Lib; spicePre: R; spiceSymbolName: R_0603_EU
U11 = RTL8367RB-VB-CG: Contributor: libc0607; link: https://www.realtek.com/en/products/communications-network-ics/item/rtl8367rb-vb-cg; spicePre: U; spiceSymbolName: RTL8367RB-VB-CG